# Altium schematic sheet Sheet1.SCHDOC
size 297 x 209 mm; SheetNumber: 1; SheetTotal: 1; DocumentName: Sheet1.SCHDOC
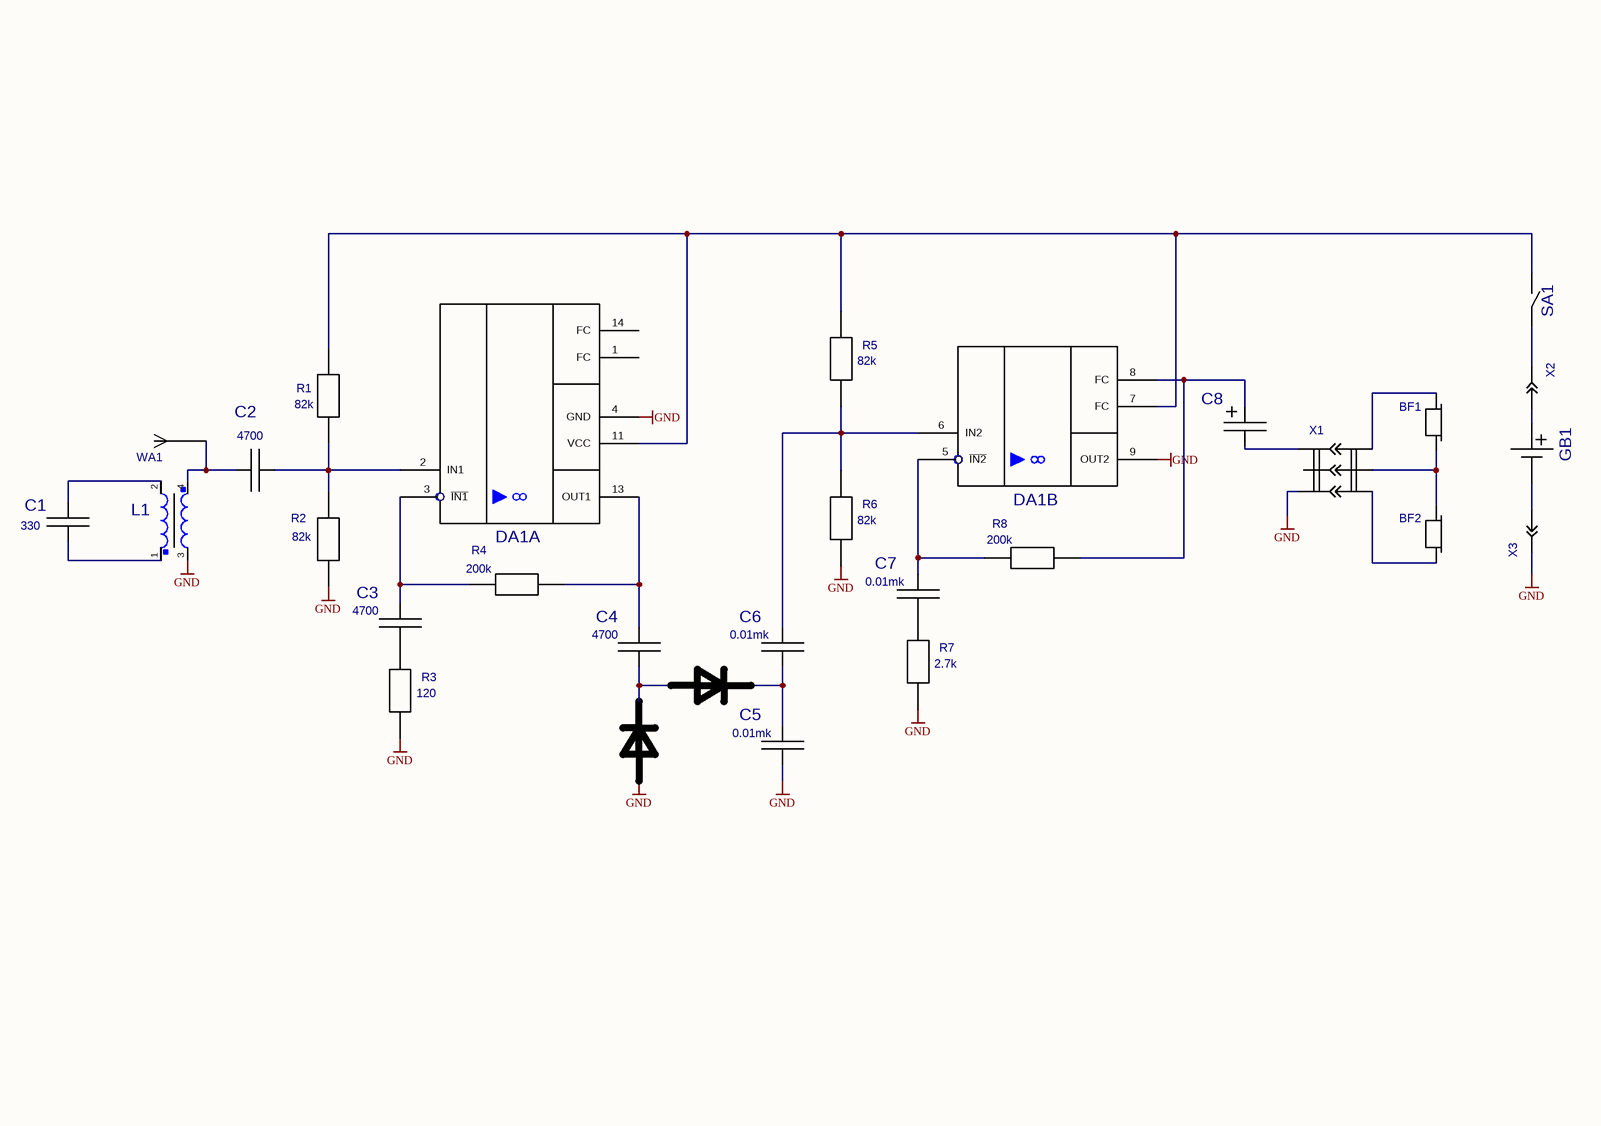
[diagram p0: Sheet1.SCHDOC]

## Parts
BF1  BF  [BF]  (value not drawn)
BF2  BF  [BF]  (value not drawn)
C1  value 330  [1017-B3R]  (hidden comment: 1017-B3R)
C2  value 4700  [1017-B3R]  (hidden comment: 1017-B3R)
C3  value 4700  [1017-B3R]  (hidden comment: 1017-B3R)
C4  value 4700  [1017-B3R]  (hidden comment: 1017-B3R)
C5  value 0.01mk  [1017-B3R]  (hidden comment: 1017-B3R)
C6  value 0.01mk  [1017-B3R]  (hidden comment: 1017-B3R)
C7  value 0.01mk  [1017-B3R]  (hidden comment: 1017-B3R)
C8  CE3528-B  [CE3528-B]  (value not drawn)
DA1  К157УД2  [DIP-14_MM]  (value not drawn)  (parts A,B of 2)
GB1  BH023(CR2032)_SMD  [BH023(CR2032)_SMD]  (value not drawn)
L1  B82722A  [B82722A]  (value not drawn)
R1  value 82k  [R100]  (hidden comment: R100)
R2  value 82k  [R100]  (hidden comment: R100)
R3  value 120  [R100]  (hidden comment: R100)
R4  value 200k  [R100]  (hidden comment: R100)
R5  value 82k  [R100]  (hidden comment: R100)
R6  value 82k  [R100]  (hidden comment: R100)
R7  value 2.7k  [R100]  (hidden comment: R100)
R8  value 200k  [R100]  (hidden comment: R100)
SA1  8AS9M2RE  [8AS9M2RE]  (value not drawn)
VD1  1N34  [DO-7]  (value not drawn)
VD2  1N34  [DO-7]  (value not drawn)
WA1  TELESKOP_ANTENNA  [TELESKOP_ANTENNA]  (value not drawn)
X1  X3  [X3]  (value not drawn)
X2  X  [X]  (value not drawn)
X3  X  [X]  (value not drawn)

## Nets
GND: C5.1(I/OA) DA1.4(GND) DA1.9(OUT2) L1.3 R2.1 R3.2 R6.2 R7.2 VD1.A X1.5 X3.1
NetBF1_1: BF1.1 BF2.2 X1.3
NetBF1_2: BF1.2 X1.2
NetBF2_1: BF2.1 X1.4
NetC1_1: C1.1(I/OA) L1.2
NetC1_2: C1.2(I/OB) L1.1
NetC2_1: C2.1(I/OA) L1.4 WA1.1
NetC2_2: C2.2(I/OB) DA1.2(IN1) R1.1 R2.2
NetC3_1: C3.1(I/OA) R3.1
NetC3_2: C3.2(I/OB) DA1.3(~{IN1}) R4.1
NetC4_1: C4.1(I/OA) VD1.K VD2.A
NetC4_2: C4.2(I/OB) DA1.13(OUT1) R4.2
NetC5_2: C5.2(I/OB) C6.1(I/OA) VD2.K
NetC6_2: C6.2(I/OB) DA1.6(IN2) R5.2 R6.1
NetC7_1: C7.1(I/OA) R7.1
NetC7_2: C7.2(I/OB) DA1.5(~{IN2}) R8.1
NetC8_1: C8.1(i/o) DA1.8(FC) R8.2
NetC8_2: C8.2(i/o1) X1.1
NetDA1_7: DA1.7(FC) DA1.11(VCC) R1.2 R5.1 SA1.1
NetGB1_1: GB1.1 X3.2
NetGB1_2: GB1.2 X2.2
NetSA1_2: SA1.2 X2.1

Not connected (* = marked no-connect by the designer): DA1 1(FC) 10 12 14(FC)

## Library data of the parts
C1-C7 = 1017-B3R: PDIF_TY: 11201
BF1 BF2 = BF: Value: *
C8 = CE3528-B: Value: *
DA1 = К157УД2: Value: *; Author: pcbdesigner.ru
GB1 = BH023(CR2032)_SMD: Value: *; Author: pcbdesigner.ru
L1 = B82722A: Author: pcbdesigner.ru
SA1 = 8AS9M2RE: Value: *; Author: pcbdesigner.ru
VD1 VD2 = 1N34: Value: *
WA1 = TELESKOP_ANTENNA: Value: *; Author: pcbdesigner.ru
X1 = X3: Value: *
X2 X3 = X: Value: *